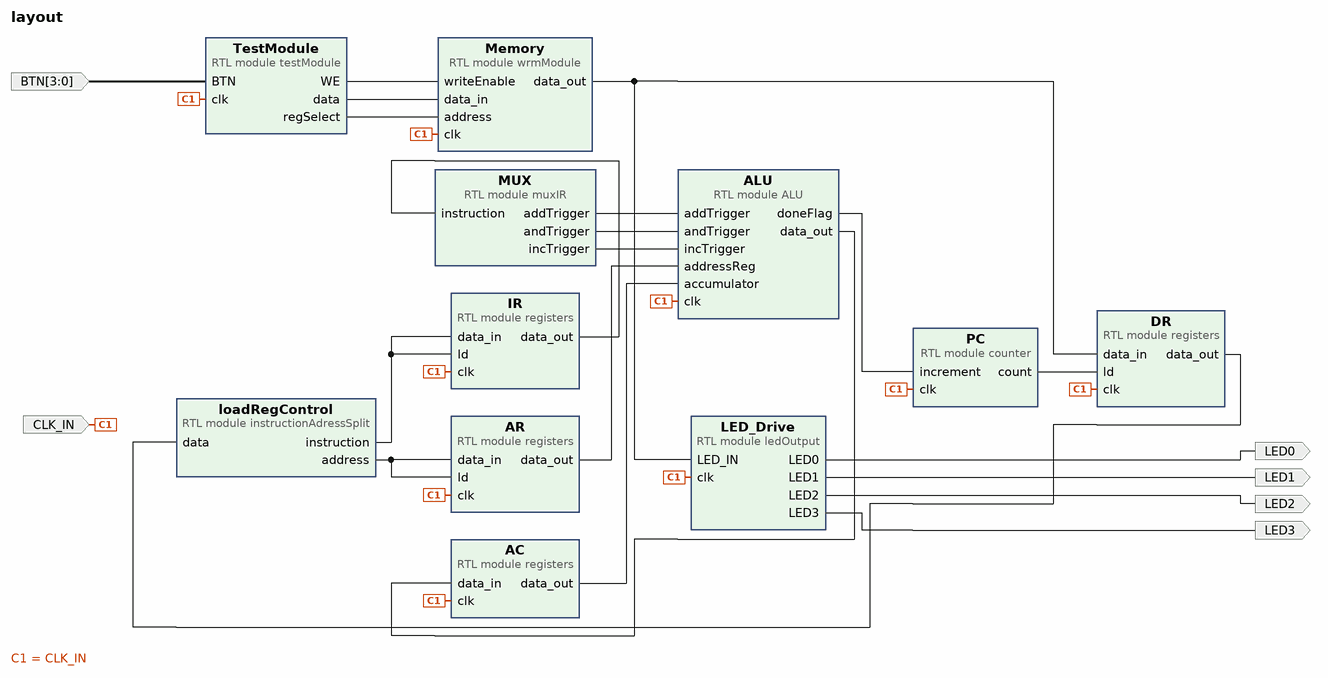
[diagram p0: block diagram of the top level]
# Vivado block design layout, xc7z020clg400-1, Vivado 2022.1
create_bd_design layout

create_bd_port -dir I -type clk CLK_IN
set_property -dict {CONFIG.FREQ_HZ 100000000} [get_bd_ports CLK_IN]
create_bd_port -dir O LED0
create_bd_port -dir O LED1
create_bd_port -dir O LED2
create_bd_port -dir O LED3
create_bd_port -dir I -from 3 -to 0 BTN

create_bd_cell -type module -reference wrmModule Memory
create_bd_cell -type module -reference ledOutput LED_Drive
create_bd_cell -type module -reference testModule TestModule
create_bd_cell -type module -reference counter PC
create_bd_cell -type module -reference registers DR
set_property -dict {CONFIG.SIZE 8} [get_bd_cells DR]
create_bd_cell -type module -reference registers AR
set_property -dict {CONFIG.SIZE 6} [get_bd_cells AR]
create_bd_cell -type module -reference registers IR
set_property -dict {CONFIG.SIZE 2} [get_bd_cells IR]
create_bd_cell -type module -reference instructionAdressSplit loadRegControl
create_bd_cell -type module -reference registers AC
create_bd_cell -type module -reference muxIR MUX
create_bd_cell -type module -reference ALU ALU

# ---- connections ----

connect_bd_net [get_bd_pins AC/data_out] [get_bd_pins ALU/accumulator]
connect_bd_net -net ALU_0_data_out [get_bd_pins ALU/data_out] [get_bd_pins AC/data_in]
connect_bd_net -net ALU_0_doneFlag [get_bd_pins ALU/doneFlag] [get_bd_pins PC/increment]
connect_bd_net [get_bd_pins AR/data_out] [get_bd_pins ALU/addressReg]
connect_bd_net [get_bd_ports BTN] [get_bd_pins TestModule/BTN]
connect_bd_net [get_bd_pins IR/data_out] [get_bd_pins MUX/instruction]
connect_bd_net -net clk_1 [get_bd_ports CLK_IN] \
  [get_bd_pins Memory/clk] [get_bd_pins LED_Drive/clk] [get_bd_pins TestModule/clk] [get_bd_pins PC/clk] [get_bd_pins DR/clk] \
  [get_bd_pins AR/clk] [get_bd_pins IR/clk] [get_bd_pins AC/clk] [get_bd_pins ALU/clk]
connect_bd_net -net counter_0_count [get_bd_pins PC/count] [get_bd_pins DR/ld]
connect_bd_net -net instructionAdressSpl_0_address [get_bd_pins loadRegControl/address] [get_bd_pins AR/data_in] [get_bd_pins AR/ld]
connect_bd_net -net instructionAdressSpl_0_instruction [get_bd_pins loadRegControl/instruction] [get_bd_pins IR/data_in] [get_bd_pins IR/ld]
connect_bd_net -net ledOutput_0_LED0 [get_bd_pins LED_Drive/LED0] [get_bd_ports LED0]
connect_bd_net -net ledOutput_0_LED1 [get_bd_pins LED_Drive/LED1] [get_bd_ports LED1]
connect_bd_net -net ledOutput_0_LED2 [get_bd_pins LED_Drive/LED2] [get_bd_ports LED2]
connect_bd_net -net ledOutput_0_LED3 [get_bd_pins LED_Drive/LED3] [get_bd_ports LED3]
connect_bd_net -net muxIR_0_addTrigger [get_bd_pins MUX/addTrigger] [get_bd_pins ALU/addTrigger]
connect_bd_net -net muxIR_0_andTrigger [get_bd_pins MUX/andTrigger] [get_bd_pins ALU/andTrigger]
connect_bd_net -net muxIR_0_incTrigger [get_bd_pins MUX/incTrigger] [get_bd_pins ALU/incTrigger]
connect_bd_net -net registers_0_data_out [get_bd_pins DR/data_out] [get_bd_pins loadRegControl/data]
connect_bd_net -net testModule_0_WE [get_bd_pins TestModule/WE] [get_bd_pins Memory/writeEnable]
connect_bd_net -net testModule_0_data [get_bd_pins TestModule/data] [get_bd_pins Memory/data_in]
connect_bd_net -net testModule_0_regSelect [get_bd_pins TestModule/regSelect] [get_bd_pins Memory/address]
connect_bd_net -net wrmModule_0_data_out [get_bd_pins Memory/data_out] [get_bd_pins LED_Drive/LED_IN] [get_bd_pins DR/data_in]

validate_bd_design
save_bd_design
